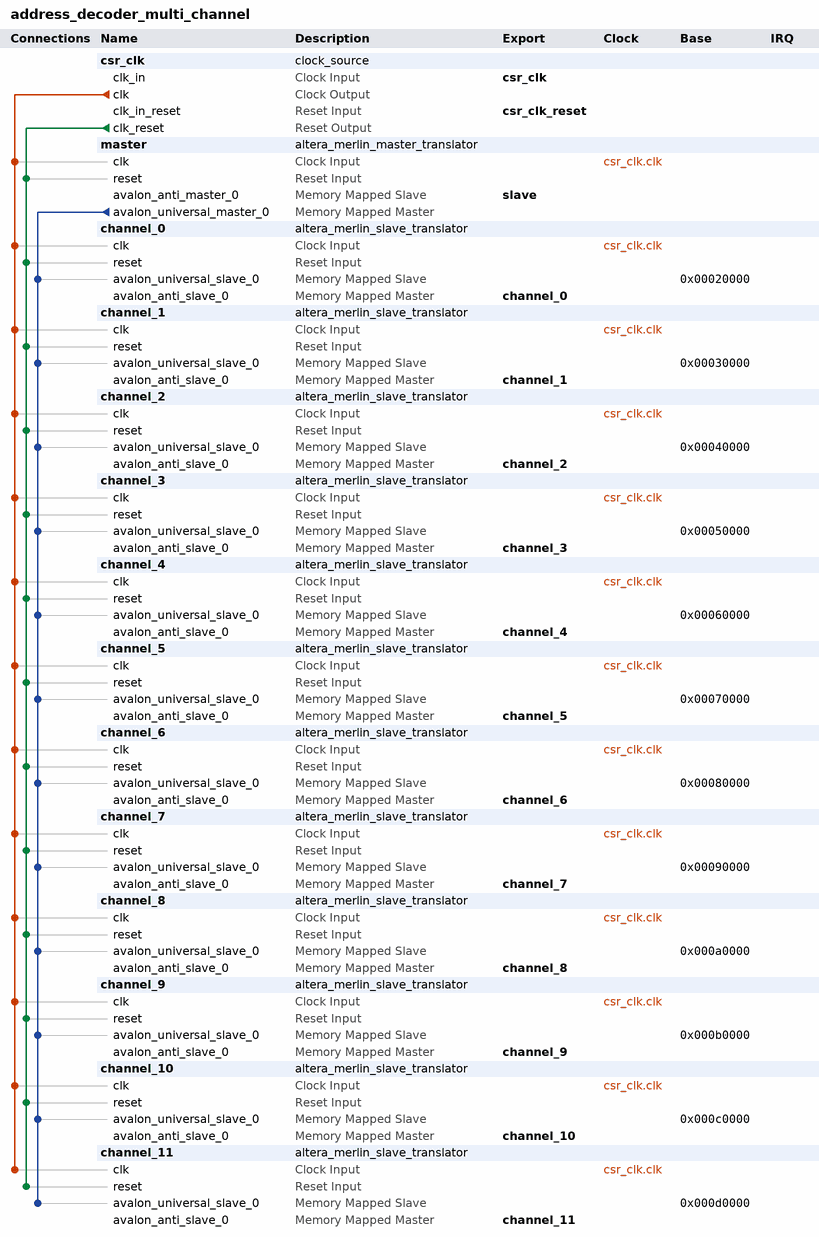
[diagram p0: system contents]
# Platform Designer (Qsys) system address_decoder_multi_channel, Cyclone 10 GX 10CX220YF780I5G
# Parameters at their usual value, and those the tool derives, are not listed.
package require -exact qsys 1.0
create_system address_decoder_multi_channel
set_project_property DEVICE_FAMILY {Cyclone 10 GX}
set_project_property DEVICE 10CX220YF780I5G

add_component csr_clk ip/address_decoder_multi_channel/address_decoder_multi_channel_csr_clk.ip clock_source csr_clk 0
load_component csr_clk
set_component_parameter_value clockFrequency 125000000
save_component

add_component master ip/address_decoder_multi_channel/address_decoder_multi_channel_master.ip altera_merlin_master_translator master 18.0
load_component master
set_component_parameter_value AV_ADDRESS_W 20
set_component_parameter_value AV_DATA_W 32
set_component_parameter_value AV_BURSTCOUNT_W 3
set_component_parameter_value AV_BYTEENABLE_W 4
set_component_parameter_value UAV_ADDRESS_W 32
set_component_parameter_value UAV_BURSTCOUNT_W 3
set_component_parameter_value AV_READLATENCY 0
set_component_parameter_value AV_WRITE_WAIT 0
set_component_parameter_value AV_READ_WAIT 0
set_component_parameter_value AV_DATA_HOLD 0
set_component_parameter_value AV_SETUP_WAIT 0
set_component_parameter_value USE_READDATA 1
set_component_parameter_value USE_WRITEDATA 1
set_component_parameter_value USE_READ 1
set_component_parameter_value USE_WRITE 1
set_component_parameter_value USE_BEGINBURSTTRANSFER 0
set_component_parameter_value USE_BEGINTRANSFER 0
set_component_parameter_value USE_BYTEENABLE 0
set_component_parameter_value USE_CHIPSELECT 0
set_component_parameter_value USE_ADDRESS 1
set_component_parameter_value USE_BURSTCOUNT 0
set_component_parameter_value USE_DEBUGACCESS 0
set_component_parameter_value USE_CLKEN 0
set_component_parameter_value USE_READDATAVALID 0
set_component_parameter_value USE_WAITREQUEST 1
set_component_parameter_value USE_LOCK 0
set_component_parameter_value USE_READRESPONSE 0
set_component_parameter_value USE_WRITERESPONSE 0
set_component_parameter_value AV_SYMBOLS_PER_WORD 4
set_component_parameter_value AV_ADDRESS_SYMBOLS 1
set_component_parameter_value AV_BURSTCOUNT_SYMBOLS 1
set_component_parameter_value AV_CONSTANT_BURST_BEHAVIOR 0
set_component_parameter_value UAV_CONSTANT_BURST_BEHAVIOR 0
set_component_parameter_value AV_LINEWRAPBURSTS 0
set_component_parameter_value AV_MAX_PENDING_READ_TRANSACTIONS 0
set_component_parameter_value AV_BURSTBOUNDARIES 0
set_component_parameter_value AV_INTERLEAVEBURSTS 0
set_component_parameter_value AV_BITS_PER_SYMBOL 8
set_component_parameter_value AV_ISBIGENDIAN 0
set_component_parameter_value AV_ADDRESSGROUP 0
set_component_parameter_value UAV_ADDRESSGROUP 0
set_component_parameter_value AV_REGISTEROUTGOINGSIGNALS 0
set_component_parameter_value AV_REGISTERINCOMINGSIGNALS 0
set_component_parameter_value AV_ALWAYSBURSTMAXBURST 0
set_component_parameter_value SYNC_RESET 0
set_component_parameter_value WAITREQUEST_ALLOWANCE 0
save_component

add_component channel_0 ip/address_decoder_multi_channel/address_decoder_multi_channel_channel_0.ip altera_merlin_slave_translator channel_0 18.0
load_component channel_0
set_component_parameter_value AV_ADDRESS_W 16
set_component_parameter_value AV_DATA_W 32
set_component_parameter_value UAV_DATA_W 32
set_component_parameter_value AV_BURSTCOUNT_W 1
set_component_parameter_value AV_BYTEENABLE_W 4
set_component_parameter_value UAV_BYTEENABLE_W 4
set_component_parameter_value UAV_ADDRESS_W 16
set_component_parameter_value UAV_BURSTCOUNT_W 3
set_component_parameter_value AV_READLATENCY 0
set_component_parameter_value AV_SETUP_WAIT 0
set_component_parameter_value AV_WRITE_WAIT 0
set_component_parameter_value AV_READ_WAIT 0
set_component_parameter_value AV_DATA_HOLD 0
set_component_parameter_value AV_TIMING_UNITS 1
set_component_parameter_value USE_READDATA 1
set_component_parameter_value USE_WRITEDATA 1
set_component_parameter_value USE_READ 1
set_component_parameter_value USE_WRITE 1
set_component_parameter_value USE_BEGINBURSTTRANSFER 0
set_component_parameter_value USE_BEGINTRANSFER 0
set_component_parameter_value USE_BYTEENABLE 0
set_component_parameter_value USE_CHIPSELECT 0
set_component_parameter_value USE_ADDRESS 1
set_component_parameter_value USE_BURSTCOUNT 0
set_component_parameter_value USE_READDATAVALID 0
set_component_parameter_value USE_WAITREQUEST 1
set_component_parameter_value USE_WRITEBYTEENABLE 0
set_component_parameter_value USE_LOCK 0
set_component_parameter_value USE_AV_CLKEN 0
set_component_parameter_value USE_UAV_CLKEN 0
set_component_parameter_value USE_OUTPUTENABLE 0
set_component_parameter_value USE_DEBUGACCESS 0
set_component_parameter_value USE_READRESPONSE 0
set_component_parameter_value USE_WRITERESPONSE 0
set_component_parameter_value AV_SYMBOLS_PER_WORD 4
set_component_parameter_value AV_ADDRESS_SYMBOLS 1
set_component_parameter_value AV_BURSTCOUNT_SYMBOLS 1
set_component_parameter_value AV_CONSTANT_BURST_BEHAVIOR 0
set_component_parameter_value UAV_CONSTANT_BURST_BEHAVIOR 0
set_component_parameter_value AV_REQUIRE_UNALIGNED_ADDRESSES 0
set_component_parameter_value AV_LINEWRAPBURSTS 0
set_component_parameter_value AV_MAX_PENDING_READ_TRANSACTIONS 1
set_component_parameter_value AV_MAX_PENDING_WRITE_TRANSACTIONS 0
set_component_parameter_value AV_BURSTBOUNDARIES 0
set_component_parameter_value AV_INTERLEAVEBURSTS 0
set_component_parameter_value AV_BITS_PER_SYMBOL 8
set_component_parameter_value AV_ISBIGENDIAN 0
set_component_parameter_value AV_ADDRESSGROUP 0
set_component_parameter_value UAV_ADDRESSGROUP 0
set_component_parameter_value AV_REGISTEROUTGOINGSIGNALS 0
set_component_parameter_value AV_REGISTERINCOMINGSIGNALS 0
set_component_parameter_value AV_ALWAYSBURSTMAXBURST 0
set_component_parameter_value CHIPSELECT_THROUGH_READLATENCY 0
set_component_parameter_value CLOCK_RATE 125000000
set_component_parameter_value AV_READ_WAIT_CYCLES 0
set_component_parameter_value AV_WRITE_WAIT_CYCLES 0
set_component_parameter_value AV_SETUP_WAIT_CYCLES 0
set_component_parameter_value AV_DATA_HOLD_CYCLES 0
set_component_parameter_value WAITREQUEST_ALLOWANCE 0
save_component

add_component channel_1 ip/address_decoder_multi_channel/address_decoder_multi_channel_channel_1.ip altera_merlin_slave_translator channel_1 18.0
load_component channel_1
set_component_parameter_value AV_ADDRESS_W 16
set_component_parameter_value AV_DATA_W 32
set_component_parameter_value UAV_DATA_W 32
set_component_parameter_value AV_BURSTCOUNT_W 1
set_component_parameter_value AV_BYTEENABLE_W 4
set_component_parameter_value UAV_BYTEENABLE_W 4
set_component_parameter_value UAV_ADDRESS_W 16
set_component_parameter_value UAV_BURSTCOUNT_W 3
set_component_parameter_value AV_READLATENCY 0
set_component_parameter_value AV_SETUP_WAIT 0
set_component_parameter_value AV_WRITE_WAIT 0
set_component_parameter_value AV_READ_WAIT 0
set_component_parameter_value AV_DATA_HOLD 0
set_component_parameter_value AV_TIMING_UNITS 1
set_component_parameter_value USE_READDATA 1
set_component_parameter_value USE_WRITEDATA 1
set_component_parameter_value USE_READ 1
set_component_parameter_value USE_WRITE 1
set_component_parameter_value USE_BEGINBURSTTRANSFER 0
set_component_parameter_value USE_BEGINTRANSFER 0
set_component_parameter_value USE_BYTEENABLE 0
set_component_parameter_value USE_CHIPSELECT 0
set_component_parameter_value USE_ADDRESS 1
set_component_parameter_value USE_BURSTCOUNT 0
set_component_parameter_value USE_READDATAVALID 0
set_component_parameter_value USE_WAITREQUEST 1
set_component_parameter_value USE_WRITEBYTEENABLE 0
set_component_parameter_value USE_LOCK 0
set_component_parameter_value USE_AV_CLKEN 0
set_component_parameter_value USE_UAV_CLKEN 0
set_component_parameter_value USE_OUTPUTENABLE 0
set_component_parameter_value USE_DEBUGACCESS 0
set_component_parameter_value USE_READRESPONSE 0
set_component_parameter_value USE_WRITERESPONSE 0
set_component_parameter_value AV_SYMBOLS_PER_WORD 4
set_component_parameter_value AV_ADDRESS_SYMBOLS 1
set_component_parameter_value AV_BURSTCOUNT_SYMBOLS 1
set_component_parameter_value AV_CONSTANT_BURST_BEHAVIOR 0
set_component_parameter_value UAV_CONSTANT_BURST_BEHAVIOR 0
set_component_parameter_value AV_REQUIRE_UNALIGNED_ADDRESSES 0
set_component_parameter_value AV_LINEWRAPBURSTS 0
set_component_parameter_value AV_MAX_PENDING_READ_TRANSACTIONS 1
set_component_parameter_value AV_MAX_PENDING_WRITE_TRANSACTIONS 0
set_component_parameter_value AV_BURSTBOUNDARIES 0
set_component_parameter_value AV_INTERLEAVEBURSTS 0
set_component_parameter_value AV_BITS_PER_SYMBOL 8
set_component_parameter_value AV_ISBIGENDIAN 0
set_component_parameter_value AV_ADDRESSGROUP 0
set_component_parameter_value UAV_ADDRESSGROUP 0
set_component_parameter_value AV_REGISTEROUTGOINGSIGNALS 0
set_component_parameter_value AV_REGISTERINCOMINGSIGNALS 0
set_component_parameter_value AV_ALWAYSBURSTMAXBURST 0
set_component_parameter_value CHIPSELECT_THROUGH_READLATENCY 0
set_component_parameter_value CLOCK_RATE 125000000
set_component_parameter_value AV_READ_WAIT_CYCLES 0
set_component_parameter_value AV_WRITE_WAIT_CYCLES 0
set_component_parameter_value AV_SETUP_WAIT_CYCLES 0
set_component_parameter_value AV_DATA_HOLD_CYCLES 0
set_component_parameter_value WAITREQUEST_ALLOWANCE 0
save_component

add_component channel_2 ip/address_decoder_multi_channel/address_decoder_multi_channel_channel_2.ip altera_merlin_slave_translator channel_2 18.0
load_component channel_2
set_component_parameter_value AV_ADDRESS_W 16
set_component_parameter_value AV_DATA_W 32
set_component_parameter_value UAV_DATA_W 32
set_component_parameter_value AV_BURSTCOUNT_W 1
set_component_parameter_value AV_BYTEENABLE_W 4
set_component_parameter_value UAV_BYTEENABLE_W 4
set_component_parameter_value UAV_ADDRESS_W 16
set_component_parameter_value UAV_BURSTCOUNT_W 3
set_component_parameter_value AV_READLATENCY 0
set_component_parameter_value AV_SETUP_WAIT 0
set_component_parameter_value AV_WRITE_WAIT 0
set_component_parameter_value AV_READ_WAIT 0
set_component_parameter_value AV_DATA_HOLD 0
set_component_parameter_value AV_TIMING_UNITS 1
set_component_parameter_value USE_READDATA 1
set_component_parameter_value USE_WRITEDATA 1
set_component_parameter_value USE_READ 1
set_component_parameter_value USE_WRITE 1
set_component_parameter_value USE_BEGINBURSTTRANSFER 0
set_component_parameter_value USE_BEGINTRANSFER 0
set_component_parameter_value USE_BYTEENABLE 0
set_component_parameter_value USE_CHIPSELECT 0
set_component_parameter_value USE_ADDRESS 1
set_component_parameter_value USE_BURSTCOUNT 0
set_component_parameter_value USE_READDATAVALID 0
set_component_parameter_value USE_WAITREQUEST 1
set_component_parameter_value USE_WRITEBYTEENABLE 0
set_component_parameter_value USE_LOCK 0
set_component_parameter_value USE_AV_CLKEN 0
set_component_parameter_value USE_UAV_CLKEN 0
set_component_parameter_value USE_OUTPUTENABLE 0
set_component_parameter_value USE_DEBUGACCESS 0
set_component_parameter_value USE_READRESPONSE 0
set_component_parameter_value USE_WRITERESPONSE 0
set_component_parameter_value AV_SYMBOLS_PER_WORD 4
set_component_parameter_value AV_ADDRESS_SYMBOLS 1
set_component_parameter_value AV_BURSTCOUNT_SYMBOLS 1
set_component_parameter_value AV_CONSTANT_BURST_BEHAVIOR 0
set_component_parameter_value UAV_CONSTANT_BURST_BEHAVIOR 0
set_component_parameter_value AV_REQUIRE_UNALIGNED_ADDRESSES 0
set_component_parameter_value AV_LINEWRAPBURSTS 0
set_component_parameter_value AV_MAX_PENDING_READ_TRANSACTIONS 1
set_component_parameter_value AV_MAX_PENDING_WRITE_TRANSACTIONS 0
set_component_parameter_value AV_BURSTBOUNDARIES 0
set_component_parameter_value AV_INTERLEAVEBURSTS 0
set_component_parameter_value AV_BITS_PER_SYMBOL 8
set_component_parameter_value AV_ISBIGENDIAN 0
set_component_parameter_value AV_ADDRESSGROUP 0
set_component_parameter_value UAV_ADDRESSGROUP 0
set_component_parameter_value AV_REGISTEROUTGOINGSIGNALS 0
set_component_parameter_value AV_REGISTERINCOMINGSIGNALS 0
set_component_parameter_value AV_ALWAYSBURSTMAXBURST 0
set_component_parameter_value CHIPSELECT_THROUGH_READLATENCY 0
set_component_parameter_value CLOCK_RATE 125000000
set_component_parameter_value AV_READ_WAIT_CYCLES 0
set_component_parameter_value AV_WRITE_WAIT_CYCLES 0
set_component_parameter_value AV_SETUP_WAIT_CYCLES 0
set_component_parameter_value AV_DATA_HOLD_CYCLES 0
set_component_parameter_value WAITREQUEST_ALLOWANCE 0
save_component

add_component channel_3 ip/address_decoder_multi_channel/address_decoder_multi_channel_channel_3.ip altera_merlin_slave_translator channel_3 18.0
load_component channel_3
set_component_parameter_value AV_ADDRESS_W 16
set_component_parameter_value AV_DATA_W 32
set_component_parameter_value UAV_DATA_W 32
set_component_parameter_value AV_BURSTCOUNT_W 1
set_component_parameter_value AV_BYTEENABLE_W 4
set_component_parameter_value UAV_BYTEENABLE_W 4
set_component_parameter_value UAV_ADDRESS_W 16
set_component_parameter_value UAV_BURSTCOUNT_W 3
set_component_parameter_value AV_READLATENCY 0
set_component_parameter_value AV_SETUP_WAIT 0
set_component_parameter_value AV_WRITE_WAIT 0
set_component_parameter_value AV_READ_WAIT 0
set_component_parameter_value AV_DATA_HOLD 0
set_component_parameter_value AV_TIMING_UNITS 1
set_component_parameter_value USE_READDATA 1
set_component_parameter_value USE_WRITEDATA 1
set_component_parameter_value USE_READ 1
set_component_parameter_value USE_WRITE 1
set_component_parameter_value USE_BEGINBURSTTRANSFER 0
set_component_parameter_value USE_BEGINTRANSFER 0
set_component_parameter_value USE_BYTEENABLE 0
set_component_parameter_value USE_CHIPSELECT 0
set_component_parameter_value USE_ADDRESS 1
set_component_parameter_value USE_BURSTCOUNT 0
set_component_parameter_value USE_READDATAVALID 0
set_component_parameter_value USE_WAITREQUEST 1
set_component_parameter_value USE_WRITEBYTEENABLE 0
set_component_parameter_value USE_LOCK 0
set_component_parameter_value USE_AV_CLKEN 0
set_component_parameter_value USE_UAV_CLKEN 0
set_component_parameter_value USE_OUTPUTENABLE 0
set_component_parameter_value USE_DEBUGACCESS 0
set_component_parameter_value USE_READRESPONSE 0
set_component_parameter_value USE_WRITERESPONSE 0
set_component_parameter_value AV_SYMBOLS_PER_WORD 4
set_component_parameter_value AV_ADDRESS_SYMBOLS 1
set_component_parameter_value AV_BURSTCOUNT_SYMBOLS 1
set_component_parameter_value AV_CONSTANT_BURST_BEHAVIOR 0
set_component_parameter_value UAV_CONSTANT_BURST_BEHAVIOR 0
set_component_parameter_value AV_REQUIRE_UNALIGNED_ADDRESSES 0
set_component_parameter_value AV_LINEWRAPBURSTS 0
set_component_parameter_value AV_MAX_PENDING_READ_TRANSACTIONS 1
set_component_parameter_value AV_MAX_PENDING_WRITE_TRANSACTIONS 0
set_component_parameter_value AV_BURSTBOUNDARIES 0
set_component_parameter_value AV_INTERLEAVEBURSTS 0
set_component_parameter_value AV_BITS_PER_SYMBOL 8
set_component_parameter_value AV_ISBIGENDIAN 0
set_component_parameter_value AV_ADDRESSGROUP 0
set_component_parameter_value UAV_ADDRESSGROUP 0
set_component_parameter_value AV_REGISTEROUTGOINGSIGNALS 0
set_component_parameter_value AV_REGISTERINCOMINGSIGNALS 0
set_component_parameter_value AV_ALWAYSBURSTMAXBURST 0
set_component_parameter_value CHIPSELECT_THROUGH_READLATENCY 0
set_component_parameter_value CLOCK_RATE 125000000
set_component_parameter_value AV_READ_WAIT_CYCLES 0
set_component_parameter_value AV_WRITE_WAIT_CYCLES 0
set_component_parameter_value AV_SETUP_WAIT_CYCLES 0
set_component_parameter_value AV_DATA_HOLD_CYCLES 0
set_component_parameter_value WAITREQUEST_ALLOWANCE 0
save_component

add_component channel_4 ip/address_decoder_multi_channel/address_decoder_multi_channel_channel_4.ip altera_merlin_slave_translator channel_4 18.0
load_component channel_4
set_component_parameter_value AV_ADDRESS_W 16
set_component_parameter_value AV_DATA_W 32
set_component_parameter_value UAV_DATA_W 32
set_component_parameter_value AV_BURSTCOUNT_W 1
set_component_parameter_value AV_BYTEENABLE_W 4
set_component_parameter_value UAV_BYTEENABLE_W 4
set_component_parameter_value UAV_ADDRESS_W 16
set_component_parameter_value UAV_BURSTCOUNT_W 3
set_component_parameter_value AV_READLATENCY 0
set_component_parameter_value AV_SETUP_WAIT 0
set_component_parameter_value AV_WRITE_WAIT 0
set_component_parameter_value AV_READ_WAIT 0
set_component_parameter_value AV_DATA_HOLD 0
set_component_parameter_value AV_TIMING_UNITS 1
set_component_parameter_value USE_READDATA 1
set_component_parameter_value USE_WRITEDATA 1
set_component_parameter_value USE_READ 1
set_component_parameter_value USE_WRITE 1
set_component_parameter_value USE_BEGINBURSTTRANSFER 0
set_component_parameter_value USE_BEGINTRANSFER 0
set_component_parameter_value USE_BYTEENABLE 0
set_component_parameter_value USE_CHIPSELECT 0
set_component_parameter_value USE_ADDRESS 1
set_component_parameter_value USE_BURSTCOUNT 0
set_component_parameter_value USE_READDATAVALID 0
set_component_parameter_value USE_WAITREQUEST 1
set_component_parameter_value USE_WRITEBYTEENABLE 0
set_component_parameter_value USE_LOCK 0
set_component_parameter_value USE_AV_CLKEN 0
set_component_parameter_value USE_UAV_CLKEN 0
set_component_parameter_value USE_OUTPUTENABLE 0
set_component_parameter_value USE_DEBUGACCESS 0
set_component_parameter_value USE_READRESPONSE 0
set_component_parameter_value USE_WRITERESPONSE 0
set_component_parameter_value AV_SYMBOLS_PER_WORD 4
set_component_parameter_value AV_ADDRESS_SYMBOLS 1
set_component_parameter_value AV_BURSTCOUNT_SYMBOLS 1
set_component_parameter_value AV_CONSTANT_BURST_BEHAVIOR 0
set_component_parameter_value UAV_CONSTANT_BURST_BEHAVIOR 0
set_component_parameter_value AV_REQUIRE_UNALIGNED_ADDRESSES 0
set_component_parameter_value AV_LINEWRAPBURSTS 0
set_component_parameter_value AV_MAX_PENDING_READ_TRANSACTIONS 1
set_component_parameter_value AV_MAX_PENDING_WRITE_TRANSACTIONS 0
set_component_parameter_value AV_BURSTBOUNDARIES 0
set_component_parameter_value AV_INTERLEAVEBURSTS 0
set_component_parameter_value AV_BITS_PER_SYMBOL 8
set_component_parameter_value AV_ISBIGENDIAN 0
set_component_parameter_value AV_ADDRESSGROUP 0
set_component_parameter_value UAV_ADDRESSGROUP 0
set_component_parameter_value AV_REGISTEROUTGOINGSIGNALS 0
set_component_parameter_value AV_REGISTERINCOMINGSIGNALS 0
set_component_parameter_value AV_ALWAYSBURSTMAXBURST 0
set_component_parameter_value CHIPSELECT_THROUGH_READLATENCY 0
set_component_parameter_value CLOCK_RATE 125000000
set_component_parameter_value AV_READ_WAIT_CYCLES 0
set_component_parameter_value AV_WRITE_WAIT_CYCLES 0
set_component_parameter_value AV_SETUP_WAIT_CYCLES 0
set_component_parameter_value AV_DATA_HOLD_CYCLES 0
set_component_parameter_value WAITREQUEST_ALLOWANCE 0
save_component

add_component channel_5 ip/address_decoder_multi_channel/address_decoder_multi_channel_channel_5.ip altera_merlin_slave_translator channel_5 18.0
load_component channel_5
set_component_parameter_value AV_ADDRESS_W 16
set_component_parameter_value AV_DATA_W 32
set_component_parameter_value UAV_DATA_W 32
set_component_parameter_value AV_BURSTCOUNT_W 1
set_component_parameter_value AV_BYTEENABLE_W 4
set_component_parameter_value UAV_BYTEENABLE_W 4
set_component_parameter_value UAV_ADDRESS_W 16
set_component_parameter_value UAV_BURSTCOUNT_W 3
set_component_parameter_value AV_READLATENCY 0
set_component_parameter_value AV_SETUP_WAIT 0
set_component_parameter_value AV_WRITE_WAIT 0
set_component_parameter_value AV_READ_WAIT 0
set_component_parameter_value AV_DATA_HOLD 0
set_component_parameter_value AV_TIMING_UNITS 1
set_component_parameter_value USE_READDATA 1
set_component_parameter_value USE_WRITEDATA 1
set_component_parameter_value USE_READ 1
set_component_parameter_value USE_WRITE 1
set_component_parameter_value USE_BEGINBURSTTRANSFER 0
set_component_parameter_value USE_BEGINTRANSFER 0
set_component_parameter_value USE_BYTEENABLE 0
set_component_parameter_value USE_CHIPSELECT 0
set_component_parameter_value USE_ADDRESS 1
set_component_parameter_value USE_BURSTCOUNT 0
set_component_parameter_value USE_READDATAVALID 0
set_component_parameter_value USE_WAITREQUEST 1
set_component_parameter_value USE_WRITEBYTEENABLE 0
set_component_parameter_value USE_LOCK 0
set_component_parameter_value USE_AV_CLKEN 0
set_component_parameter_value USE_UAV_CLKEN 0
set_component_parameter_value USE_OUTPUTENABLE 0
set_component_parameter_value USE_DEBUGACCESS 0
set_component_parameter_value USE_READRESPONSE 0
set_component_parameter_value USE_WRITERESPONSE 0
set_component_parameter_value AV_SYMBOLS_PER_WORD 4
set_component_parameter_value AV_ADDRESS_SYMBOLS 1
set_component_parameter_value AV_BURSTCOUNT_SYMBOLS 1
set_component_parameter_value AV_CONSTANT_BURST_BEHAVIOR 0
set_component_parameter_value UAV_CONSTANT_BURST_BEHAVIOR 0
set_component_parameter_value AV_REQUIRE_UNALIGNED_ADDRESSES 0
set_component_parameter_value AV_LINEWRAPBURSTS 0
set_component_parameter_value AV_MAX_PENDING_READ_TRANSACTIONS 1
set_component_parameter_value AV_MAX_PENDING_WRITE_TRANSACTIONS 0
set_component_parameter_value AV_BURSTBOUNDARIES 0
set_component_parameter_value AV_INTERLEAVEBURSTS 0
set_component_parameter_value AV_BITS_PER_SYMBOL 8
set_component_parameter_value AV_ISBIGENDIAN 0
set_component_parameter_value AV_ADDRESSGROUP 0
set_component_parameter_value UAV_ADDRESSGROUP 0
set_component_parameter_value AV_REGISTEROUTGOINGSIGNALS 0
set_component_parameter_value AV_REGISTERINCOMINGSIGNALS 0
set_component_parameter_value AV_ALWAYSBURSTMAXBURST 0
set_component_parameter_value CHIPSELECT_THROUGH_READLATENCY 0
set_component_parameter_value CLOCK_RATE 125000000
set_component_parameter_value AV_READ_WAIT_CYCLES 0
set_component_parameter_value AV_WRITE_WAIT_CYCLES 0
set_component_parameter_value AV_SETUP_WAIT_CYCLES 0
set_component_parameter_value AV_DATA_HOLD_CYCLES 0
set_component_parameter_value WAITREQUEST_ALLOWANCE 0
save_component

add_component channel_6 ip/address_decoder_multi_channel/address_decoder_multi_channel_channel_6.ip altera_merlin_slave_translator channel_6 18.0
load_component channel_6
set_component_parameter_value AV_ADDRESS_W 16
set_component_parameter_value AV_DATA_W 32
set_component_parameter_value UAV_DATA_W 32
set_component_parameter_value AV_BURSTCOUNT_W 1
set_component_parameter_value AV_BYTEENABLE_W 4
set_component_parameter_value UAV_BYTEENABLE_W 4
set_component_parameter_value UAV_ADDRESS_W 16
set_component_parameter_value UAV_BURSTCOUNT_W 3
set_component_parameter_value AV_READLATENCY 0
set_component_parameter_value AV_SETUP_WAIT 0
set_component_parameter_value AV_WRITE_WAIT 0
set_component_parameter_value AV_READ_WAIT 0
set_component_parameter_value AV_DATA_HOLD 0
set_component_parameter_value AV_TIMING_UNITS 1
set_component_parameter_value USE_READDATA 1
set_component_parameter_value USE_WRITEDATA 1
set_component_parameter_value USE_READ 1
set_component_parameter_value USE_WRITE 1
set_component_parameter_value USE_BEGINBURSTTRANSFER 0
set_component_parameter_value USE_BEGINTRANSFER 0
set_component_parameter_value USE_BYTEENABLE 0
set_component_parameter_value USE_CHIPSELECT 0
set_component_parameter_value USE_ADDRESS 1
set_component_parameter_value USE_BURSTCOUNT 0
set_component_parameter_value USE_READDATAVALID 0
set_component_parameter_value USE_WAITREQUEST 1
set_component_parameter_value USE_WRITEBYTEENABLE 0
set_component_parameter_value USE_LOCK 0
set_component_parameter_value USE_AV_CLKEN 0
set_component_parameter_value USE_UAV_CLKEN 0
set_component_parameter_value USE_OUTPUTENABLE 0
set_component_parameter_value USE_DEBUGACCESS 0
set_component_parameter_value USE_READRESPONSE 0
set_component_parameter_value USE_WRITERESPONSE 0
set_component_parameter_value AV_SYMBOLS_PER_WORD 4
set_component_parameter_value AV_ADDRESS_SYMBOLS 1
set_component_parameter_value AV_BURSTCOUNT_SYMBOLS 1
set_component_parameter_value AV_CONSTANT_BURST_BEHAVIOR 0
set_component_parameter_value UAV_CONSTANT_BURST_BEHAVIOR 0
set_component_parameter_value AV_REQUIRE_UNALIGNED_ADDRESSES 0
set_component_parameter_value AV_LINEWRAPBURSTS 0
set_component_parameter_value AV_MAX_PENDING_READ_TRANSACTIONS 1
set_component_parameter_value AV_MAX_PENDING_WRITE_TRANSACTIONS 0
set_component_parameter_value AV_BURSTBOUNDARIES 0
set_component_parameter_value AV_INTERLEAVEBURSTS 0
set_component_parameter_value AV_BITS_PER_SYMBOL 8
set_component_parameter_value AV_ISBIGENDIAN 0
set_component_parameter_value AV_ADDRESSGROUP 0
set_component_parameter_value UAV_ADDRESSGROUP 0
set_component_parameter_value AV_REGISTEROUTGOINGSIGNALS 0
set_component_parameter_value AV_REGISTERINCOMINGSIGNALS 0
set_component_parameter_value AV_ALWAYSBURSTMAXBURST 0
set_component_parameter_value CHIPSELECT_THROUGH_READLATENCY 0
set_component_parameter_value CLOCK_RATE 125000000
set_component_parameter_value AV_READ_WAIT_CYCLES 0
set_component_parameter_value AV_WRITE_WAIT_CYCLES 0
set_component_parameter_value AV_SETUP_WAIT_CYCLES 0
set_component_parameter_value AV_DATA_HOLD_CYCLES 0
set_component_parameter_value WAITREQUEST_ALLOWANCE 0
save_component

add_component channel_7 ip/address_decoder_multi_channel/address_decoder_multi_channel_channel_7.ip altera_merlin_slave_translator channel_7 18.0
load_component channel_7
set_component_parameter_value AV_ADDRESS_W 16
set_component_parameter_value AV_DATA_W 32
set_component_parameter_value UAV_DATA_W 32
set_component_parameter_value AV_BURSTCOUNT_W 1
set_component_parameter_value AV_BYTEENABLE_W 4
set_component_parameter_value UAV_BYTEENABLE_W 4
set_component_parameter_value UAV_ADDRESS_W 16
set_component_parameter_value UAV_BURSTCOUNT_W 3
set_component_parameter_value AV_READLATENCY 0
set_component_parameter_value AV_SETUP_WAIT 0
set_component_parameter_value AV_WRITE_WAIT 0
set_component_parameter_value AV_READ_WAIT 0
set_component_parameter_value AV_DATA_HOLD 0
set_component_parameter_value AV_TIMING_UNITS 1
set_component_parameter_value USE_READDATA 1
set_component_parameter_value USE_WRITEDATA 1
set_component_parameter_value USE_READ 1
set_component_parameter_value USE_WRITE 1
set_component_parameter_value USE_BEGINBURSTTRANSFER 0
set_component_parameter_value USE_BEGINTRANSFER 0
set_component_parameter_value USE_BYTEENABLE 0
set_component_parameter_value USE_CHIPSELECT 0
set_component_parameter_value USE_ADDRESS 1
set_component_parameter_value USE_BURSTCOUNT 0
set_component_parameter_value USE_READDATAVALID 0
set_component_parameter_value USE_WAITREQUEST 1
set_component_parameter_value USE_WRITEBYTEENABLE 0
set_component_parameter_value USE_LOCK 0
set_component_parameter_value USE_AV_CLKEN 0
set_component_parameter_value USE_UAV_CLKEN 0
set_component_parameter_value USE_OUTPUTENABLE 0
set_component_parameter_value USE_DEBUGACCESS 0
set_component_parameter_value USE_READRESPONSE 0
set_component_parameter_value USE_WRITERESPONSE 0
set_component_parameter_value AV_SYMBOLS_PER_WORD 4
set_component_parameter_value AV_ADDRESS_SYMBOLS 1
set_component_parameter_value AV_BURSTCOUNT_SYMBOLS 1
set_component_parameter_value AV_CONSTANT_BURST_BEHAVIOR 0
set_component_parameter_value UAV_CONSTANT_BURST_BEHAVIOR 0
set_component_parameter_value AV_REQUIRE_UNALIGNED_ADDRESSES 0
set_component_parameter_value AV_LINEWRAPBURSTS 0
set_component_parameter_value AV_MAX_PENDING_READ_TRANSACTIONS 1
set_component_parameter_value AV_MAX_PENDING_WRITE_TRANSACTIONS 0
set_component_parameter_value AV_BURSTBOUNDARIES 0
set_component_parameter_value AV_INTERLEAVEBURSTS 0
set_component_parameter_value AV_BITS_PER_SYMBOL 8
set_component_parameter_value AV_ISBIGENDIAN 0
set_component_parameter_value AV_ADDRESSGROUP 0
set_component_parameter_value UAV_ADDRESSGROUP 0
set_component_parameter_value AV_REGISTEROUTGOINGSIGNALS 0
set_component_parameter_value AV_REGISTERINCOMINGSIGNALS 0
set_component_parameter_value AV_ALWAYSBURSTMAXBURST 0
set_component_parameter_value CHIPSELECT_THROUGH_READLATENCY 0
set_component_parameter_value CLOCK_RATE 125000000
set_component_parameter_value AV_READ_WAIT_CYCLES 0
set_component_parameter_value AV_WRITE_WAIT_CYCLES 0
set_component_parameter_value AV_SETUP_WAIT_CYCLES 0
set_component_parameter_value AV_DATA_HOLD_CYCLES 0
set_component_parameter_value WAITREQUEST_ALLOWANCE 0
save_component

add_component channel_8 ip/address_decoder_multi_channel/address_decoder_multi_channel_channel_8.ip altera_merlin_slave_translator channel_8 18.0
load_component channel_8
set_component_parameter_value AV_ADDRESS_W 16
set_component_parameter_value AV_DATA_W 32
set_component_parameter_value UAV_DATA_W 32
set_component_parameter_value AV_BURSTCOUNT_W 1
set_component_parameter_value AV_BYTEENABLE_W 4
set_component_parameter_value UAV_BYTEENABLE_W 4
set_component_parameter_value UAV_ADDRESS_W 16
set_component_parameter_value UAV_BURSTCOUNT_W 3
set_component_parameter_value AV_READLATENCY 0
set_component_parameter_value AV_SETUP_WAIT 0
set_component_parameter_value AV_WRITE_WAIT 0
set_component_parameter_value AV_READ_WAIT 0
set_component_parameter_value AV_DATA_HOLD 0
set_component_parameter_value AV_TIMING_UNITS 1
set_component_parameter_value USE_READDATA 1
set_component_parameter_value USE_WRITEDATA 1
set_component_parameter_value USE_READ 1
set_component_parameter_value USE_WRITE 1
set_component_parameter_value USE_BEGINBURSTTRANSFER 0
set_component_parameter_value USE_BEGINTRANSFER 0
set_component_parameter_value USE_BYTEENABLE 0
set_component_parameter_value USE_CHIPSELECT 0
set_component_parameter_value USE_ADDRESS 1
set_component_parameter_value USE_BURSTCOUNT 0
set_component_parameter_value USE_READDATAVALID 0
set_component_parameter_value USE_WAITREQUEST 1
set_component_parameter_value USE_WRITEBYTEENABLE 0
set_component_parameter_value USE_LOCK 0
set_component_parameter_value USE_AV_CLKEN 0
set_component_parameter_value USE_UAV_CLKEN 0
set_component_parameter_value USE_OUTPUTENABLE 0
set_component_parameter_value USE_DEBUGACCESS 0
set_component_parameter_value USE_READRESPONSE 0
set_component_parameter_value USE_WRITERESPONSE 0
set_component_parameter_value AV_SYMBOLS_PER_WORD 4
set_component_parameter_value AV_ADDRESS_SYMBOLS 1
set_component_parameter_value AV_BURSTCOUNT_SYMBOLS 1
set_component_parameter_value AV_CONSTANT_BURST_BEHAVIOR 0
set_component_parameter_value UAV_CONSTANT_BURST_BEHAVIOR 0
set_component_parameter_value AV_REQUIRE_UNALIGNED_ADDRESSES 0
set_component_parameter_value AV_LINEWRAPBURSTS 0
set_component_parameter_value AV_MAX_PENDING_READ_TRANSACTIONS 1
set_component_parameter_value AV_MAX_PENDING_WRITE_TRANSACTIONS 0
set_component_parameter_value AV_BURSTBOUNDARIES 0
set_component_parameter_value AV_INTERLEAVEBURSTS 0
set_component_parameter_value AV_BITS_PER_SYMBOL 8
set_component_parameter_value AV_ISBIGENDIAN 0
set_component_parameter_value AV_ADDRESSGROUP 0
set_component_parameter_value UAV_ADDRESSGROUP 0
set_component_parameter_value AV_REGISTEROUTGOINGSIGNALS 0
set_component_parameter_value AV_REGISTERINCOMINGSIGNALS 0
set_component_parameter_value AV_ALWAYSBURSTMAXBURST 0
set_component_parameter_value CHIPSELECT_THROUGH_READLATENCY 0
set_component_parameter_value CLOCK_RATE 125000000
set_component_parameter_value AV_READ_WAIT_CYCLES 0
set_component_parameter_value AV_WRITE_WAIT_CYCLES 0
set_component_parameter_value AV_SETUP_WAIT_CYCLES 0
set_component_parameter_value AV_DATA_HOLD_CYCLES 0
set_component_parameter_value WAITREQUEST_ALLOWANCE 0
save_component

add_component channel_9 ip/address_decoder_multi_channel/address_decoder_multi_channel_channel_9.ip altera_merlin_slave_translator channel_9 18.0
load_component channel_9
set_component_parameter_value AV_ADDRESS_W 16
set_component_parameter_value AV_DATA_W 32
set_component_parameter_value UAV_DATA_W 32
set_component_parameter_value AV_BURSTCOUNT_W 1
set_component_parameter_value AV_BYTEENABLE_W 4
set_component_parameter_value UAV_BYTEENABLE_W 4
set_component_parameter_value UAV_ADDRESS_W 16
set_component_parameter_value UAV_BURSTCOUNT_W 3
set_component_parameter_value AV_READLATENCY 0
set_component_parameter_value AV_SETUP_WAIT 0
set_component_parameter_value AV_WRITE_WAIT 0
set_component_parameter_value AV_READ_WAIT 0
set_component_parameter_value AV_DATA_HOLD 0
set_component_parameter_value AV_TIMING_UNITS 1
set_component_parameter_value USE_READDATA 1
set_component_parameter_value USE_WRITEDATA 1
set_component_parameter_value USE_READ 1
set_component_parameter_value USE_WRITE 1
set_component_parameter_value USE_BEGINBURSTTRANSFER 0
set_component_parameter_value USE_BEGINTRANSFER 0
set_component_parameter_value USE_BYTEENABLE 0
set_component_parameter_value USE_CHIPSELECT 0
set_component_parameter_value USE_ADDRESS 1
set_component_parameter_value USE_BURSTCOUNT 0
set_component_parameter_value USE_READDATAVALID 0
set_component_parameter_value USE_WAITREQUEST 1
set_component_parameter_value USE_WRITEBYTEENABLE 0
set_component_parameter_value USE_LOCK 0
set_component_parameter_value USE_AV_CLKEN 0
set_component_parameter_value USE_UAV_CLKEN 0
set_component_parameter_value USE_OUTPUTENABLE 0
set_component_parameter_value USE_DEBUGACCESS 0
set_component_parameter_value USE_READRESPONSE 0
set_component_parameter_value USE_WRITERESPONSE 0
set_component_parameter_value AV_SYMBOLS_PER_WORD 4
set_component_parameter_value AV_ADDRESS_SYMBOLS 1
set_component_parameter_value AV_BURSTCOUNT_SYMBOLS 1
set_component_parameter_value AV_CONSTANT_BURST_BEHAVIOR 0
set_component_parameter_value UAV_CONSTANT_BURST_BEHAVIOR 0
set_component_parameter_value AV_REQUIRE_UNALIGNED_ADDRESSES 0
set_component_parameter_value AV_LINEWRAPBURSTS 0
set_component_parameter_value AV_MAX_PENDING_READ_TRANSACTIONS 1
set_component_parameter_value AV_MAX_PENDING_WRITE_TRANSACTIONS 0
set_component_parameter_value AV_BURSTBOUNDARIES 0
set_component_parameter_value AV_INTERLEAVEBURSTS 0
set_component_parameter_value AV_BITS_PER_SYMBOL 8
set_component_parameter_value AV_ISBIGENDIAN 0
set_component_parameter_value AV_ADDRESSGROUP 0
set_component_parameter_value UAV_ADDRESSGROUP 0
set_component_parameter_value AV_REGISTEROUTGOINGSIGNALS 0
set_component_parameter_value AV_REGISTERINCOMINGSIGNALS 0
set_component_parameter_value AV_ALWAYSBURSTMAXBURST 0
set_component_parameter_value CHIPSELECT_THROUGH_READLATENCY 0
set_component_parameter_value CLOCK_RATE 125000000
set_component_parameter_value AV_READ_WAIT_CYCLES 0
set_component_parameter_value AV_WRITE_WAIT_CYCLES 0
set_component_parameter_value AV_SETUP_WAIT_CYCLES 0
set_component_parameter_value AV_DATA_HOLD_CYCLES 0
set_component_parameter_value WAITREQUEST_ALLOWANCE 0
save_component

add_component channel_10 ip/address_decoder_multi_channel/address_decoder_multi_channel_channel_10.ip altera_merlin_slave_translator channel_10 18.0
load_component channel_10
set_component_parameter_value AV_ADDRESS_W 16
set_component_parameter_value AV_DATA_W 32
set_component_parameter_value UAV_DATA_W 32
set_component_parameter_value AV_BURSTCOUNT_W 1
set_component_parameter_value AV_BYTEENABLE_W 4
set_component_parameter_value UAV_BYTEENABLE_W 4
set_component_parameter_value UAV_ADDRESS_W 16
set_component_parameter_value UAV_BURSTCOUNT_W 3
set_component_parameter_value AV_READLATENCY 0
set_component_parameter_value AV_SETUP_WAIT 0
set_component_parameter_value AV_WRITE_WAIT 0
set_component_parameter_value AV_READ_WAIT 0
set_component_parameter_value AV_DATA_HOLD 0
set_component_parameter_value AV_TIMING_UNITS 1
set_component_parameter_value USE_READDATA 1
set_component_parameter_value USE_WRITEDATA 1
set_component_parameter_value USE_READ 1
set_component_parameter_value USE_WRITE 1
set_component_parameter_value USE_BEGINBURSTTRANSFER 0
set_component_parameter_value USE_BEGINTRANSFER 0
set_component_parameter_value USE_BYTEENABLE 0
set_component_parameter_value USE_CHIPSELECT 0
set_component_parameter_value USE_ADDRESS 1
set_component_parameter_value USE_BURSTCOUNT 0
set_component_parameter_value USE_READDATAVALID 0
set_component_parameter_value USE_WAITREQUEST 1
set_component_parameter_value USE_WRITEBYTEENABLE 0
set_component_parameter_value USE_LOCK 0
set_component_parameter_value USE_AV_CLKEN 0
set_component_parameter_value USE_UAV_CLKEN 0
set_component_parameter_value USE_OUTPUTENABLE 0
set_component_parameter_value USE_DEBUGACCESS 0
set_component_parameter_value USE_READRESPONSE 0
set_component_parameter_value USE_WRITERESPONSE 0
set_component_parameter_value AV_SYMBOLS_PER_WORD 4
set_component_parameter_value AV_ADDRESS_SYMBOLS 1
set_component_parameter_value AV_BURSTCOUNT_SYMBOLS 1
set_component_parameter_value AV_CONSTANT_BURST_BEHAVIOR 0
set_component_parameter_value UAV_CONSTANT_BURST_BEHAVIOR 0
set_component_parameter_value AV_REQUIRE_UNALIGNED_ADDRESSES 0
set_component_parameter_value AV_LINEWRAPBURSTS 0
set_component_parameter_value AV_MAX_PENDING_READ_TRANSACTIONS 1
set_component_parameter_value AV_MAX_PENDING_WRITE_TRANSACTIONS 0
set_component_parameter_value AV_BURSTBOUNDARIES 0
set_component_parameter_value AV_INTERLEAVEBURSTS 0
set_component_parameter_value AV_BITS_PER_SYMBOL 8
set_component_parameter_value AV_ISBIGENDIAN 0
set_component_parameter_value AV_ADDRESSGROUP 0
set_component_parameter_value UAV_ADDRESSGROUP 0
set_component_parameter_value AV_REGISTEROUTGOINGSIGNALS 0
set_component_parameter_value AV_REGISTERINCOMINGSIGNALS 0
set_component_parameter_value AV_ALWAYSBURSTMAXBURST 0
set_component_parameter_value CHIPSELECT_THROUGH_READLATENCY 0
set_component_parameter_value CLOCK_RATE 125000000
set_component_parameter_value AV_READ_WAIT_CYCLES 0
set_component_parameter_value AV_WRITE_WAIT_CYCLES 0
set_component_parameter_value AV_SETUP_WAIT_CYCLES 0
set_component_parameter_value AV_DATA_HOLD_CYCLES 0
set_component_parameter_value WAITREQUEST_ALLOWANCE 0
save_component

add_component channel_11 ip/address_decoder_multi_channel/address_decoder_multi_channel_channel_11.ip altera_merlin_slave_translator channel_11 18.0
load_component channel_11
set_component_parameter_value AV_ADDRESS_W 16
set_component_parameter_value AV_DATA_W 32
set_component_parameter_value UAV_DATA_W 32
set_component_parameter_value AV_BURSTCOUNT_W 1
set_component_parameter_value AV_BYTEENABLE_W 4
set_component_parameter_value UAV_BYTEENABLE_W 4
set_component_parameter_value UAV_ADDRESS_W 16
set_component_parameter_value UAV_BURSTCOUNT_W 3
set_component_parameter_value AV_READLATENCY 0
set_component_parameter_value AV_SETUP_WAIT 0
set_component_parameter_value AV_WRITE_WAIT 0
set_component_parameter_value AV_READ_WAIT 0
set_component_parameter_value AV_DATA_HOLD 0
set_component_parameter_value AV_TIMING_UNITS 1
set_component_parameter_value USE_READDATA 1
set_component_parameter_value USE_WRITEDATA 1
set_component_parameter_value USE_READ 1
set_component_parameter_value USE_WRITE 1
set_component_parameter_value USE_BEGINBURSTTRANSFER 0
set_component_parameter_value USE_BEGINTRANSFER 0
set_component_parameter_value USE_BYTEENABLE 0
set_component_parameter_value USE_CHIPSELECT 0
set_component_parameter_value USE_ADDRESS 1
set_component_parameter_value USE_BURSTCOUNT 0
set_component_parameter_value USE_READDATAVALID 0
set_component_parameter_value USE_WAITREQUEST 1
set_component_parameter_value USE_WRITEBYTEENABLE 0
set_component_parameter_value USE_LOCK 0
set_component_parameter_value USE_AV_CLKEN 0
set_component_parameter_value USE_UAV_CLKEN 0
set_component_parameter_value USE_OUTPUTENABLE 0
set_component_parameter_value USE_DEBUGACCESS 0
set_component_parameter_value USE_READRESPONSE 0
set_component_parameter_value USE_WRITERESPONSE 0
set_component_parameter_value AV_SYMBOLS_PER_WORD 4
set_component_parameter_value AV_ADDRESS_SYMBOLS 1
set_component_parameter_value AV_BURSTCOUNT_SYMBOLS 1
set_component_parameter_value AV_CONSTANT_BURST_BEHAVIOR 0
set_component_parameter_value UAV_CONSTANT_BURST_BEHAVIOR 0
set_component_parameter_value AV_REQUIRE_UNALIGNED_ADDRESSES 0
set_component_parameter_value AV_LINEWRAPBURSTS 0
set_component_parameter_value AV_MAX_PENDING_READ_TRANSACTIONS 1
set_component_parameter_value AV_MAX_PENDING_WRITE_TRANSACTIONS 0
set_component_parameter_value AV_BURSTBOUNDARIES 0
set_component_parameter_value AV_INTERLEAVEBURSTS 0
set_component_parameter_value AV_BITS_PER_SYMBOL 8
set_component_parameter_value AV_ISBIGENDIAN 0
set_component_parameter_value AV_ADDRESSGROUP 0
set_component_parameter_value UAV_ADDRESSGROUP 0
set_component_parameter_value AV_REGISTEROUTGOINGSIGNALS 0
set_component_parameter_value AV_REGISTERINCOMINGSIGNALS 0
set_component_parameter_value AV_ALWAYSBURSTMAXBURST 0
set_component_parameter_value CHIPSELECT_THROUGH_READLATENCY 0
set_component_parameter_value CLOCK_RATE 125000000
set_component_parameter_value AV_READ_WAIT_CYCLES 0
set_component_parameter_value AV_WRITE_WAIT_CYCLES 0
set_component_parameter_value AV_SETUP_WAIT_CYCLES 0
set_component_parameter_value AV_DATA_HOLD_CYCLES 0
set_component_parameter_value WAITREQUEST_ALLOWANCE 0
save_component

# connections
add_connection csr_clk.clk channel_0.clk clock
add_connection csr_clk.clk channel_1.clk clock
add_connection csr_clk.clk channel_2.clk clock
add_connection csr_clk.clk channel_3.clk clock
add_connection csr_clk.clk channel_4.clk clock
add_connection csr_clk.clk channel_5.clk clock
add_connection csr_clk.clk channel_6.clk clock
add_connection csr_clk.clk channel_7.clk clock
add_connection csr_clk.clk channel_8.clk clock
add_connection csr_clk.clk channel_9.clk clock
add_connection csr_clk.clk channel_10.clk clock
add_connection csr_clk.clk channel_11.clk clock
add_connection csr_clk.clk master.clk clock
add_connection csr_clk.clk_reset channel_0.reset reset
add_connection csr_clk.clk_reset channel_1.reset reset
add_connection csr_clk.clk_reset channel_2.reset reset
add_connection csr_clk.clk_reset channel_3.reset reset
add_connection csr_clk.clk_reset channel_4.reset reset
add_connection csr_clk.clk_reset channel_5.reset reset
add_connection csr_clk.clk_reset channel_6.reset reset
add_connection csr_clk.clk_reset channel_7.reset reset
add_connection csr_clk.clk_reset channel_8.reset reset
add_connection csr_clk.clk_reset channel_9.reset reset
add_connection csr_clk.clk_reset channel_10.reset reset
add_connection csr_clk.clk_reset channel_11.reset reset
add_connection csr_clk.clk_reset master.reset reset
add_connection master.avalon_universal_master_0 channel_0.avalon_universal_slave_0 avalon
set_connection_parameter_value master.avalon_universal_master_0/channel_0.avalon_universal_slave_0 baseAddress 0x00020000
add_connection master.avalon_universal_master_0 channel_1.avalon_universal_slave_0 avalon
set_connection_parameter_value master.avalon_universal_master_0/channel_1.avalon_universal_slave_0 baseAddress 0x00030000
add_connection master.avalon_universal_master_0 channel_2.avalon_universal_slave_0 avalon
set_connection_parameter_value master.avalon_universal_master_0/channel_2.avalon_universal_slave_0 baseAddress 0x00040000
add_connection master.avalon_universal_master_0 channel_3.avalon_universal_slave_0 avalon
set_connection_parameter_value master.avalon_universal_master_0/channel_3.avalon_universal_slave_0 baseAddress 0x00050000
add_connection master.avalon_universal_master_0 channel_4.avalon_universal_slave_0 avalon
set_connection_parameter_value master.avalon_universal_master_0/channel_4.avalon_universal_slave_0 baseAddress 0x00060000
add_connection master.avalon_universal_master_0 channel_5.avalon_universal_slave_0 avalon
set_connection_parameter_value master.avalon_universal_master_0/channel_5.avalon_universal_slave_0 baseAddress 0x00070000
add_connection master.avalon_universal_master_0 channel_6.avalon_universal_slave_0 avalon
set_connection_parameter_value master.avalon_universal_master_0/channel_6.avalon_universal_slave_0 baseAddress 0x00080000
add_connection master.avalon_universal_master_0 channel_7.avalon_universal_slave_0 avalon
set_connection_parameter_value master.avalon_universal_master_0/channel_7.avalon_universal_slave_0 baseAddress 0x00090000
add_connection master.avalon_universal_master_0 channel_8.avalon_universal_slave_0 avalon
set_connection_parameter_value master.avalon_universal_master_0/channel_8.avalon_universal_slave_0 baseAddress 0x000a0000
add_connection master.avalon_universal_master_0 channel_9.avalon_universal_slave_0 avalon
set_connection_parameter_value master.avalon_universal_master_0/channel_9.avalon_universal_slave_0 baseAddress 0x000b0000
add_connection master.avalon_universal_master_0 channel_10.avalon_universal_slave_0 avalon
set_connection_parameter_value master.avalon_universal_master_0/channel_10.avalon_universal_slave_0 baseAddress 0x000c0000
add_connection master.avalon_universal_master_0 channel_11.avalon_universal_slave_0 avalon
set_connection_parameter_value master.avalon_universal_master_0/channel_11.avalon_universal_slave_0 baseAddress 0x000d0000

# exported interfaces
add_interface channel_0 avalon master
set_interface_property channel_0 EXPORT_OF channel_0.avalon_anti_slave_0
add_interface channel_1 avalon master
set_interface_property channel_1 EXPORT_OF channel_1.avalon_anti_slave_0
add_interface channel_10 avalon master
set_interface_property channel_10 EXPORT_OF channel_10.avalon_anti_slave_0
add_interface channel_11 avalon master
set_interface_property channel_11 EXPORT_OF channel_11.avalon_anti_slave_0
add_interface channel_2 avalon master
set_interface_property channel_2 EXPORT_OF channel_2.avalon_anti_slave_0
add_interface channel_3 avalon master
set_interface_property channel_3 EXPORT_OF channel_3.avalon_anti_slave_0
add_interface channel_4 avalon master
set_interface_property channel_4 EXPORT_OF channel_4.avalon_anti_slave_0
add_interface channel_5 avalon master
set_interface_property channel_5 EXPORT_OF channel_5.avalon_anti_slave_0
add_interface channel_6 avalon master
set_interface_property channel_6 EXPORT_OF channel_6.avalon_anti_slave_0
add_interface channel_7 avalon master
set_interface_property channel_7 EXPORT_OF channel_7.avalon_anti_slave_0
add_interface channel_8 avalon master
set_interface_property channel_8 EXPORT_OF channel_8.avalon_anti_slave_0
add_interface channel_9 avalon master
set_interface_property channel_9 EXPORT_OF channel_9.avalon_anti_slave_0
add_interface csr_clk clock sink
set_interface_property csr_clk EXPORT_OF csr_clk.clk_in
add_interface csr_clk_reset reset sink
set_interface_property csr_clk_reset EXPORT_OF csr_clk.clk_in_reset
add_interface slave avalon slave
set_interface_property slave EXPORT_OF master.avalon_anti_master_0

set_interconnect_requirement {$system} qsys_mm.clockCrossingAdapter HANDSHAKE
set_interconnect_requirement {$system} qsys_mm.maxAdditionalLatency 1

save_system address_decoder_multi_channel.qsys
